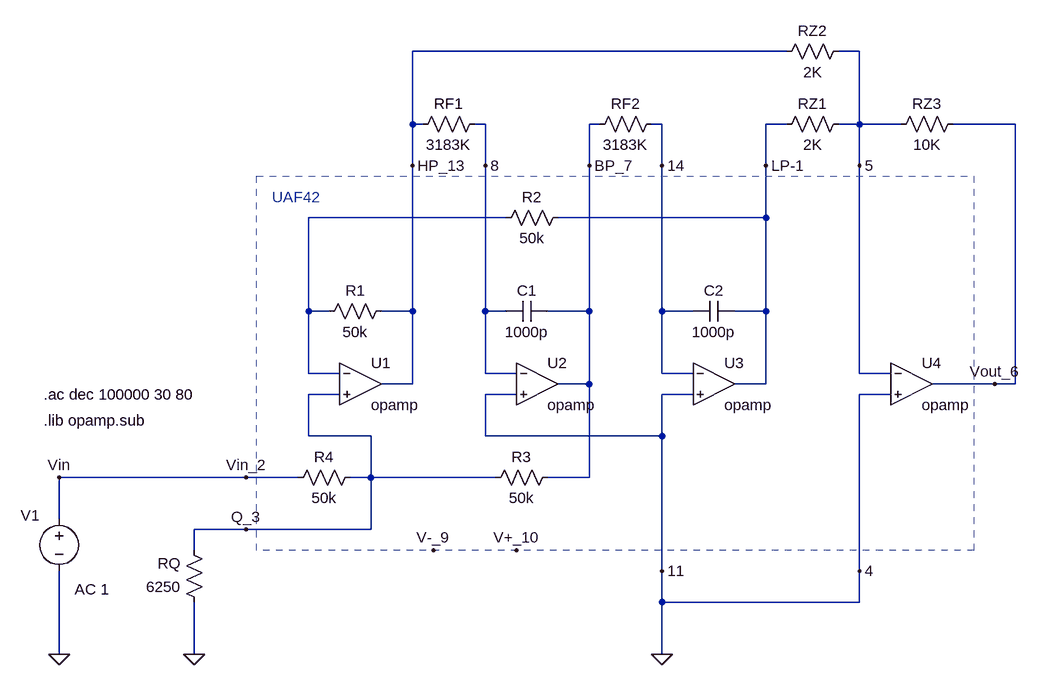
[diagram p0: schematic UAF42.asc]
UAF42.asc, the LTspice schematic file:
Version 4
SHEET 1 1428 964
WIRE 1008 -16 432 -16
WIRE 1120 -16 1088 -16
WIRE 432 96 432 -16
WIRE 448 96 432 96
WIRE 544 96 528 96
WIRE 720 96 704 96
WIRE 816 96 800 96
WIRE 1008 96 976 96
WIRE 1120 96 1120 -16
WIRE 1120 96 1088 96
WIRE 1184 96 1120 96
WIRE 1360 96 1264 96
WIRE 432 160 432 96
WIRE 544 160 544 96
WIRE 704 160 704 96
WIRE 816 160 816 96
WIRE 976 160 976 96
WIRE 1120 160 1120 96
WIRE 576 240 272 240
WIRE 976 240 976 160
WIRE 976 240 656 240
WIRE 272 384 272 240
WIRE 304 384 272 384
WIRE 432 384 432 160
WIRE 432 384 384 384
WIRE 544 384 544 160
WIRE 576 384 544 384
WIRE 704 384 704 160
WIRE 704 384 640 384
WIRE 816 384 816 160
WIRE 864 384 816 384
WIRE 976 384 976 240
WIRE 976 384 928 384
WIRE 272 480 272 384
WIRE 320 480 272 480
WIRE 544 480 544 384
WIRE 592 480 544 480
WIRE 816 480 816 384
WIRE 864 480 816 480
WIRE 1120 480 1120 160
WIRE 1168 480 1120 480
WIRE 432 496 432 384
WIRE 432 496 384 496
WIRE 704 496 704 384
WIRE 704 496 656 496
WIRE 976 496 976 384
WIRE 976 496 928 496
WIRE 1328 496 1232 496
WIRE 1360 496 1360 96
WIRE 1360 496 1328 496
WIRE 320 512 272 512
WIRE 592 512 544 512
WIRE 864 512 816 512
WIRE 1168 512 1120 512
WIRE 272 576 272 512
WIRE 368 576 272 576
WIRE 544 576 544 512
WIRE 816 576 816 512
WIRE 816 576 544 576
WIRE 176 640 -112 640
WIRE 256 640 176 640
WIRE 368 640 368 576
WIRE 368 640 336 640
WIRE 560 640 368 640
WIRE 704 640 704 496
WIRE 704 640 640 640
WIRE -112 704 -112 640
WIRE 176 720 96 720
WIRE 368 720 368 640
WIRE 368 720 176 720
WIRE 96 752 96 720
WIRE 816 784 816 576
WIRE 1120 784 1120 512
WIRE 816 832 816 784
WIRE 1120 832 1120 784
WIRE 1120 832 816 832
WIRE -112 912 -112 784
WIRE 96 912 96 832
WIRE 816 912 816 832
FLAG -112 640 Vin
FLAG 432 160 HP_13
FLAG 544 160 8
FLAG 704 160 BP_7
FLAG 464 752 V-_9
FLAG 592 752 V+_10
FLAG 816 160 14
FLAG 976 160 LP-1
FLAG 176 640 Vin_2
FLAG 176 720 Q_3
FLAG 1120 160 5
FLAG 1328 496 Vout_6
FLAG 1120 784 4
FLAG 816 784 11
FLAG 96 912 0
FLAG 816 912 0
FLAG -112 912 0
SYMBOL voltage -112 688 R0
WINDOW 123 24 124 Left 2
WINDOW 39 0 0 Left 0
WINDOW 0 -59 10 Left 2
SYMATTR Value2 AC 1
SYMATTR InstName V1
SYMATTR Value ""
SYMBOL OpAmps\\opamp 352 432 R0
SYMATTR InstName U1
SYMBOL OpAmps\\opamp 624 432 R0
SYMATTR InstName U2
SYMBOL OpAmps\\opamp 896 432 R0
SYMATTR InstName U3
SYMBOL OpAmps\\opamp 1200 432 R0
SYMATTR InstName U4
SYMBOL cap 640 368 R90
WINDOW 0 0 32 VBottom 2
WINDOW 3 32 32 VTop 2
SYMATTR InstName C1
SYMATTR Value 1000p
SYMBOL cap 928 368 R90
WINDOW 0 0 32 VBottom 2
WINDOW 3 32 32 VTop 2
SYMATTR InstName C2
SYMATTR Value 1000p
SYMBOL res 400 368 R90
WINDOW 0 0 56 VBottom 2
WINDOW 3 32 56 VTop 2
SYMATTR InstName R1
SYMATTR Value 50k
SYMBOL res 672 224 R90
WINDOW 0 0 56 VBottom 2
WINDOW 3 32 56 VTop 2
SYMATTR InstName R2
SYMATTR Value 50k
SYMBOL res 656 624 R90
WINDOW 0 0 56 VBottom 2
WINDOW 3 32 56 VTop 2
SYMATTR InstName R3
SYMATTR Value 50k
SYMBOL res 352 624 R90
WINDOW 0 0 56 VBottom 2
WINDOW 3 32 56 VTop 2
SYMATTR InstName R4
SYMATTR Value 50k
SYMBOL res 1280 80 R90
WINDOW 0 0 56 VBottom 2
WINDOW 3 32 56 VTop 2
SYMATTR InstName RZ3
SYMATTR Value 10K
SYMBOL res 1104 80 R90
WINDOW 0 0 56 VBottom 2
WINDOW 3 32 56 VTop 2
SYMATTR InstName RZ1
SYMATTR Value 2K
SYMBOL res 1104 -32 R90
WINDOW 0 0 56 VBottom 2
WINDOW 3 32 56 VTop 2
SYMATTR InstName RZ2
SYMATTR Value 2K
SYMBOL res 816 80 R90
WINDOW 0 0 56 VBottom 2
WINDOW 3 32 56 VTop 2
SYMATTR InstName RF2
SYMATTR Value 3183K
SYMBOL res 544 80 R90
WINDOW 0 0 56 VBottom 2
WINDOW 3 32 56 VTop 2
SYMATTR InstName RF1
SYMATTR Value 3183K
SYMBOL res 112 848 R180
WINDOW 0 36 76 Left 2
WINDOW 3 36 40 Left 2
SYMATTR InstName RQ
SYMATTR Value 6250
TEXT -136 552 Left 2 !.lib opamp.sub
TEXT -136 512 Left 2 !.ac dec 100000 30 80
TEXT 216 208 Left 2 ;UAF42
RECTANGLE Normal 1296 752 192 176 2

The netlist it stands for:
* UAF42.asc
V1 Vin_2 0 AC 1
XU1 N001 Q_3 HP_13 opamp Aol=100K GBW=10Meg  ; pins invin noninvin out
XU2 8 0 BP_7 opamp Aol=100K GBW=10Meg  ; pins invin noninvin out
XU3 14 0 LP-1 opamp Aol=100K GBW=10Meg  ; pins invin noninvin out
XU4 5 0 Vout_6 opamp Aol=100K GBW=10Meg  ; pins invin noninvin out
C1 BP_7 8 1000p
C2 LP-1 14 1000p
R1 HP_13 N001 50k
R2 LP-1 N001 50k
R3 BP_7 Q_3 50k
R4 Q_3 Vin_2 50k
RZ3 Vout_6 5 10K
RZ1 5 LP-1 2K
RZ2 5 HP_13 2K
RF2 14 BP_7 3183K
RF1 8 HP_13 3183K
RQ 0 Q_3 6250
.lib opamp.sub
.ac dec 100000 30 80
* UAF42
.backanno
.end